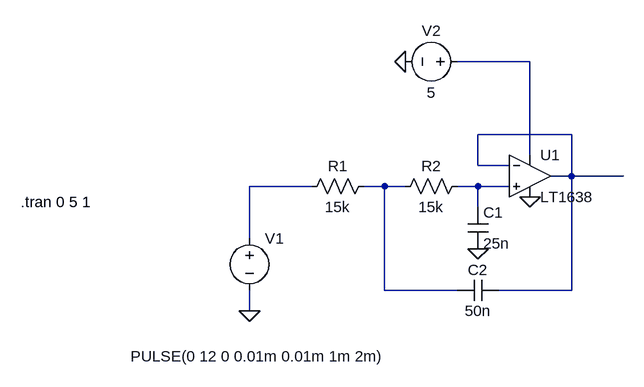
[diagram p0: schematic Sallen-Key Low-pass Filter.asc]
Sallen-Key Low-pass Filter.asc, the LTspice schematic file:
Version 4
SHEET 1 880 680
WIRE 208 -16 96 -16
WIRE 272 96 128 96
WIRE 208 128 208 -16
WIRE 128 144 128 96
WIRE 176 144 128 144
WIRE 272 160 272 96
WIRE 272 160 240 160
WIRE 352 160 272 160
WIRE -128 176 -224 176
WIRE -16 176 -48 176
WIRE 16 176 -16 176
WIRE 128 176 96 176
WIRE 176 176 128 176
WIRE 128 208 128 176
WIRE -224 256 -224 176
WIRE -16 336 -16 176
WIRE 96 336 -16 336
WIRE 272 336 272 160
WIRE 272 336 160 336
WIRE -224 368 -224 336
FLAG 128 272 0
FLAG -224 368 0
FLAG 208 192 0
FLAG 16 -16 0
SYMBOL OpAmps\\LT1638 208 96 R0
SYMATTR InstName U1
SYMBOL res -32 160 R90
WINDOW 0 0 56 VBottom 2
WINDOW 3 32 56 VTop 2
SYMATTR InstName R1
SYMATTR Value 15k
SYMBOL res 112 160 R90
WINDOW 0 0 56 VBottom 2
WINDOW 3 32 56 VTop 2
SYMATTR InstName R2
SYMATTR Value 15k
SYMBOL cap 112 208 R0
SYMATTR InstName C1
SYMATTR Value 25n
SYMBOL cap 160 320 R90
WINDOW 0 0 32 VBottom 2
WINDOW 3 32 32 VTop 2
SYMATTR InstName C2
SYMATTR Value 50n
SYMBOL voltage -224 240 R0
WINDOW 3 -183 198 Left 2
WINDOW 123 0 0 Left 0
WINDOW 39 0 0 Left 0
SYMATTR InstName V1
SYMATTR Value PULSE(0 12 0 0.01m 0.01m 1m 2m)
SYMBOL voltage 112 -16 R90
WINDOW 0 -32 56 VBottom 2
WINDOW 3 32 56 VTop 2
WINDOW 123 0 0 Left 0
WINDOW 39 0 0 Left 0
SYMATTR InstName V2
SYMATTR Value 5
TEXT -576 200 Left 2 !.tran 0 5 1

The netlist it stands for:
* Sallen-Key Low-pass Filter.asc
XU1 N005 N002 N001 0 N002 LT1638  ; pins In+ In- V+ V- OUT
R1 N004 N003 15k
R2 N005 N004 15k
C1 N005 0 25n
C2 N002 N004 50n
V1 N003 0 PULSE(0 12 0 0.01m 0.01m 1m 2m)
V2 N001 0 5
.tran 0 5 1
.backanno
.end